# Altium project ESP32_S3_V2.1.PrjPcb
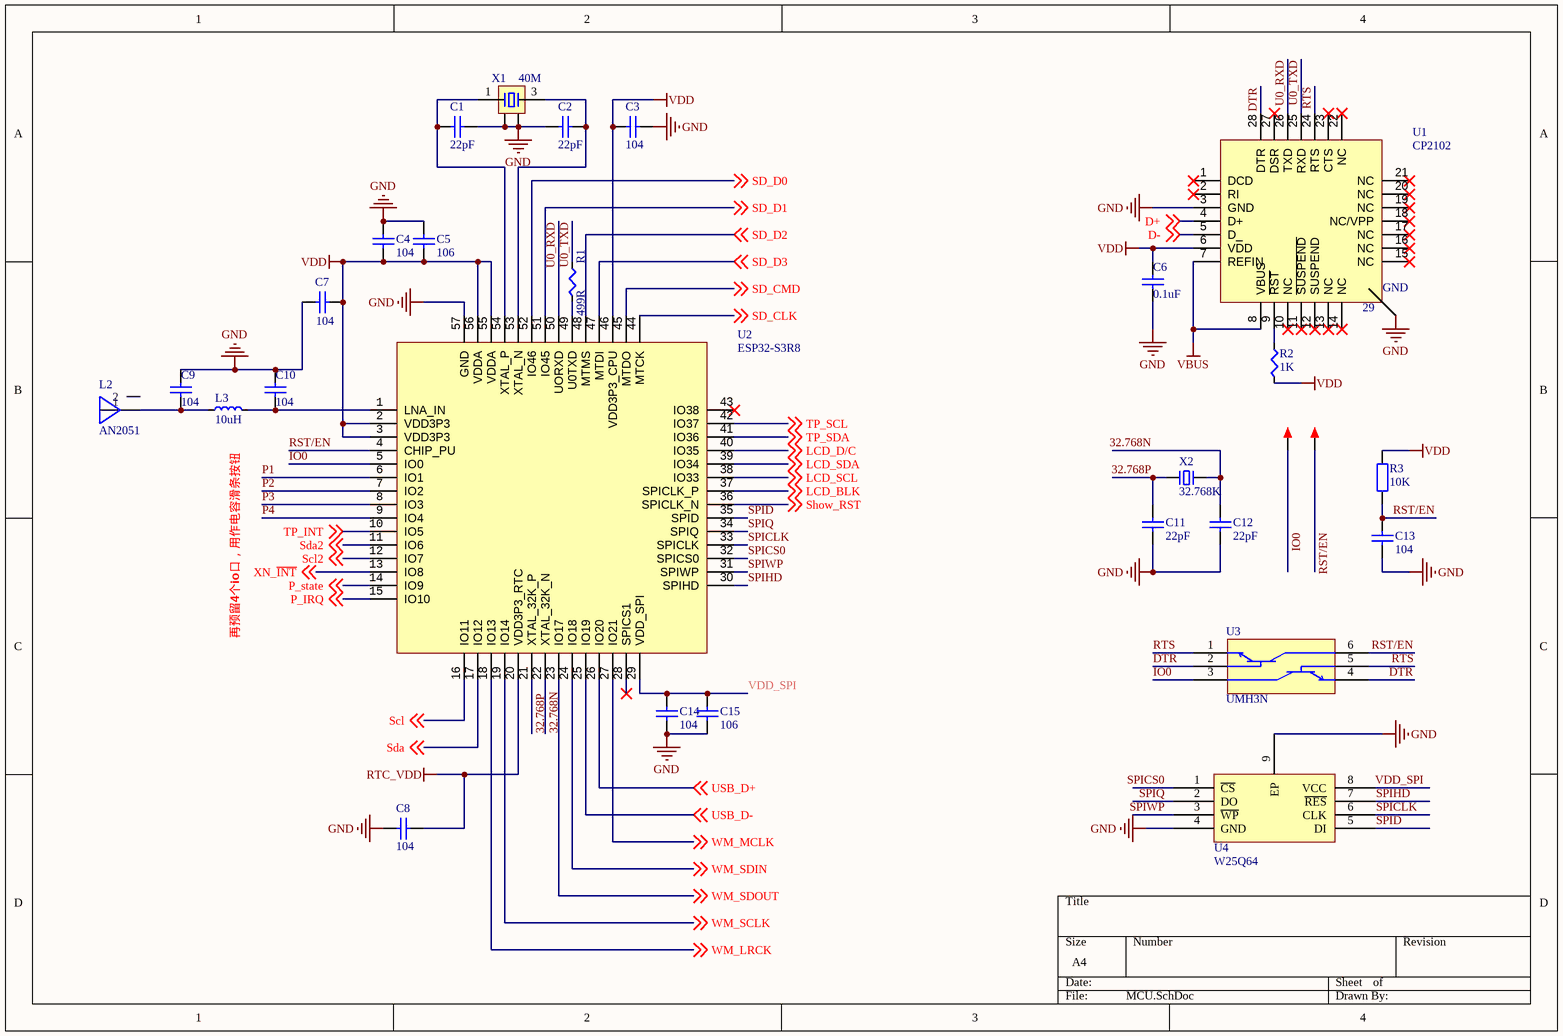
[diagram p0: MCU.SchDoc]
3 sheets, 117 parts. Net scope: global (net labels, ports and power ports of the same name join across sheets).
Board file: PCB1.~(1).PcbDoc
Sheets:
  MCU.SchDoc
  peripheral.SchDoc
  power.SchDoc

## Sheet MCU.SchDoc
size A4; SheetNumber: 1; SheetTotal: 3

### Parts
C1  22pF  [C 0603_L]
C2  22pF  [C 0603_L]
C3  104  [C 0603_L]
C4  104  [C 0603_L]
C5  106  [C 0603_L]
C6  0.1uF  [C 0603_L]
C7  104  [C 0603_L]
C8  104  [C 0603_L]
C9  104  [C 0603_L]
C10  104  [C 0603_L]
C11  22pF  [C 0603_L]
C12  22pF  [C 0603_L]
C13  104  [C 0603_L]
C14  104  [C 0603_L]
C15  106  [C 0603_L]
L2  AN2051  [AN9520]
L3  10uH  [L 0603]
R1  499R  [R 0603_L]
R2  1K  [R 0603_L]
R3  10K  [R 0603_L]
TP1  TEST  [TEST 1]  (value not drawn)
TP2  TEST  [TEST 1]  (value not drawn)
U1  CP2102  [QFN28 5x5_M]
U2  ESP32-S3R8  [QFN56  7x7]
U3  UMH3N  [SOT-363]
U4  W25Q64  [WSON-8_L8.0-W6.0-P1.27-TL-EP]
X1  40M  [OSC 3225-4P]
X2  32.768K  [OSC 3215-2P]

### Nets
GND: C1.2 C2.1 C3.2 C4.2 C5.2 C6.1 C7.1 C8.2 C9.2 C10.2 C11.1 C12.1 C13.1 C14.1 C15.1 U1.3(GND) U1.29(GND) U2.57(GND) U4.4(GND) U4.9(EP) X1.2 X1.4
RTC_VDD: C8.1 U2.20(VDD3P3_RTC)
VBUS: U1.7(REFIN) U1.8(VBUS)
VDD: C3.1 C4.1 C5.1 C6.2 C7.2 R2.1 R3.2 U1.6(VDD) U2.2(VDD3P3) U2.3(VDD3P3) U2.46(VDD3P3_CPU) U2.55(VDDA) U2.56(VDDA)
32.768N: C12.2 U2.22(XTAL_32K_N) X2.1
32.768P: C11.2 U2.21(XTAL_32K_P) X2.2
D+: U1.4(D+) ; off-sheet D+
D-: U1.5(D_) ; off-sheet D-
DTR: U1.28(DTR) U3.2(B2) U3.4(E2)
IO0: TP1.1 U2.5(IO0) U3.3(C2)
LCD_BLK: U2.37(SPICLK_P) ; off-sheet LCD_BLK
LCD_D/C: U2.40(IO35) ; off-sheet LCD_D/C
LCD_SCL: U2.38(IO33) ; off-sheet LCD_SCL
LCD_SDA: U2.39(IO34) ; off-sheet LCD_SDA
P1: U2.6(IO1)
P2: U2.7(IO2)
P3: U2.8(IO3)
P4: U2.9(IO4)
P_IRQ: U2.15(IO10) ; off-sheet P_IRQ
P_state: U2.14(IO9) ; off-sheet P_state
RST/EN: C13.2 R3.1 TP2.1 U2.4(CHIP_PU) U3.6(C1)
RTS: U1.24(RTS) U3.1(E1) U3.5(B2)
Scl: U2.16(IO11) ; off-sheet Scl
Scl2: U2.12(IO7) ; off-sheet Scl2
SD_CLK: U2.44(MTCK) ; off-sheet SD_CLK
SD_CMD: U2.45(MTDO) ; off-sheet SD_CMD
SD_D0: U2.52(IO46) ; off-sheet SD_D0
SD_D1: U2.51(IO45) ; off-sheet SD_D1
SD_D2: U2.48(MTMS) ; off-sheet SD_D2
SD_D3: U2.47(MTDI) ; off-sheet SD_D3
Sda: U2.17(IO12) ; off-sheet Sda
Sda2: U2.11(IO6) ; off-sheet Sda2
Show_RST: U2.36(SPICLK_N) ; off-sheet Show_RST
SPICLK: U2.33(SPICLK) U4.6(CLK)
SPICS0: U2.32(SPICS0) U4.1(~{CS})
SPID: U2.35(SPID) U4.5(DI)
SPIHD: U2.30(SPIHD) U4.7(~{RES})
SPIQ: U2.34(SPIQ) U4.2(DO)
SPIWP: U2.31(SPIWP) U4.3(~{WP})
TP_INT: U2.10(IO5) ; off-sheet TP_INT
TP_SCL: U2.42(IO37) ; off-sheet TP_SCL
TP_SDA: U2.41(IO36) ; off-sheet TP_SDA
U0_RXD: U1.26(TXD) U2.50(UORXD)
U0_TXD: R1.2 U1.25(RXD)
USB_D+: U2.26(IO20) ; off-sheet USB_D+
USB_D-: U2.25(IO19) ; off-sheet USB_D-
VDD_SPI: C14.2 C15.2 U2.29(VDD_SPI) U4.8(VCC)
WM_LRCK: U2.18(IO13) ; off-sheet WM_LRCK
WM_MCLK: U2.27(IO21) ; off-sheet WM_MCLK
WM_SCLK: U2.19(IO14) ; off-sheet WM_SCLK
WM_SDIN: U2.24(IO18) ; off-sheet WM_SDIN
WM_SDOUT: U2.23(IO17) ; off-sheet WM_SDOUT
XN_~{INT}: U2.13(IO8) ; off-sheet XN_~{INT}
NetC1_1: C1.1 U2.54(XTAL_P) X1.1
NetC2_2: C2.2 U2.53(XTAL_N) X1.3
NetC9_1: C9.1 L2.1 L3.1
NetC10_1: C10.1 L3.2 U2.1(LNA_IN)
NetR1_1: R1.1 U2.49(U0TXD)
NetR2_2: R2.2 U1.9(~{RST})

Not connected (* = marked no-connect by the designer): L2 2; U1 1(DCD)* 2(RI)* 10(NC)* 11(~{SUSPEND})* 12(SUSPEND)* 13(NC)* 14(NC)* 15(NC)* 16(NC)* 17(NC)* 18(NC/VPP)* 19(NC)* 20(NC)* 21(NC)* 22(NC)* 23(CTS)* 27(DSR)*; U2 28(SPICS1)* 43(IO38)*

### Notes on the sheet
- 再预留4个io口，用作电容滑条按钮

### Library data of the parts
C1-C15 = C: 贴片电容; BOM名称: 无极性贴片电容; 联系卖家，免费查找封装: 唯一出售店铺网址https://shop463601444.taobao.com; 封装库来自淘宝卖家ID：黄晶宝石: 其他店铺购入均为盗版假冒封装库
L2 = AN2051: AN2051-245 2.4G蓝牙wifi 贴片 2051
L3 = L: 小功率贴片电感; 联系卖家，免费查找封装: 唯一出售店铺网址https://shop463601444.taobao.com; 封装库来自淘宝卖家ID：黄晶宝石: 其他店铺购入均为盗版假冒封装库; BOM名称: 小功率贴片电感
R1-R3 = R: 贴片电阻; 联系卖家，免费查找封装: 唯一出售店铺网址https://shop463601444.taobao.com; 封装库来自淘宝卖家ID：黄晶宝石: 其他店铺购入均为盗版假冒封装库; BOM名称: 贴片电阻
TP1 TP2 = TEST: 测试点; 联系卖家，免费查找封装: 唯一出售店铺网址https://shop463601444.taobao.com; BOM名称: 测试点
U1 = CP2102: USB转TTL
U2 = ESP32S3: ESP32S3  7x7
U3 = UMH3N: 2NPN预偏式(双)
U4 = W25Q64——wson: C77819
X1 = XTAL-4P: 4脚无源晶振; 联系卖家，免费查找封装: 唯一出售店铺网址https://shop463601444.taobao.com; BOM名称: 4脚无源晶振
X2 = XTAL-2P: 2脚无源脚晶振; 联系卖家，免费查找封装: 唯一出售店铺网址https://shop463601444.taobao.com; BOM名称: 2脚无源脚晶振

## Sheet peripheral.SchDoc
size A4; SheetNumber: 2; SheetTotal: 3
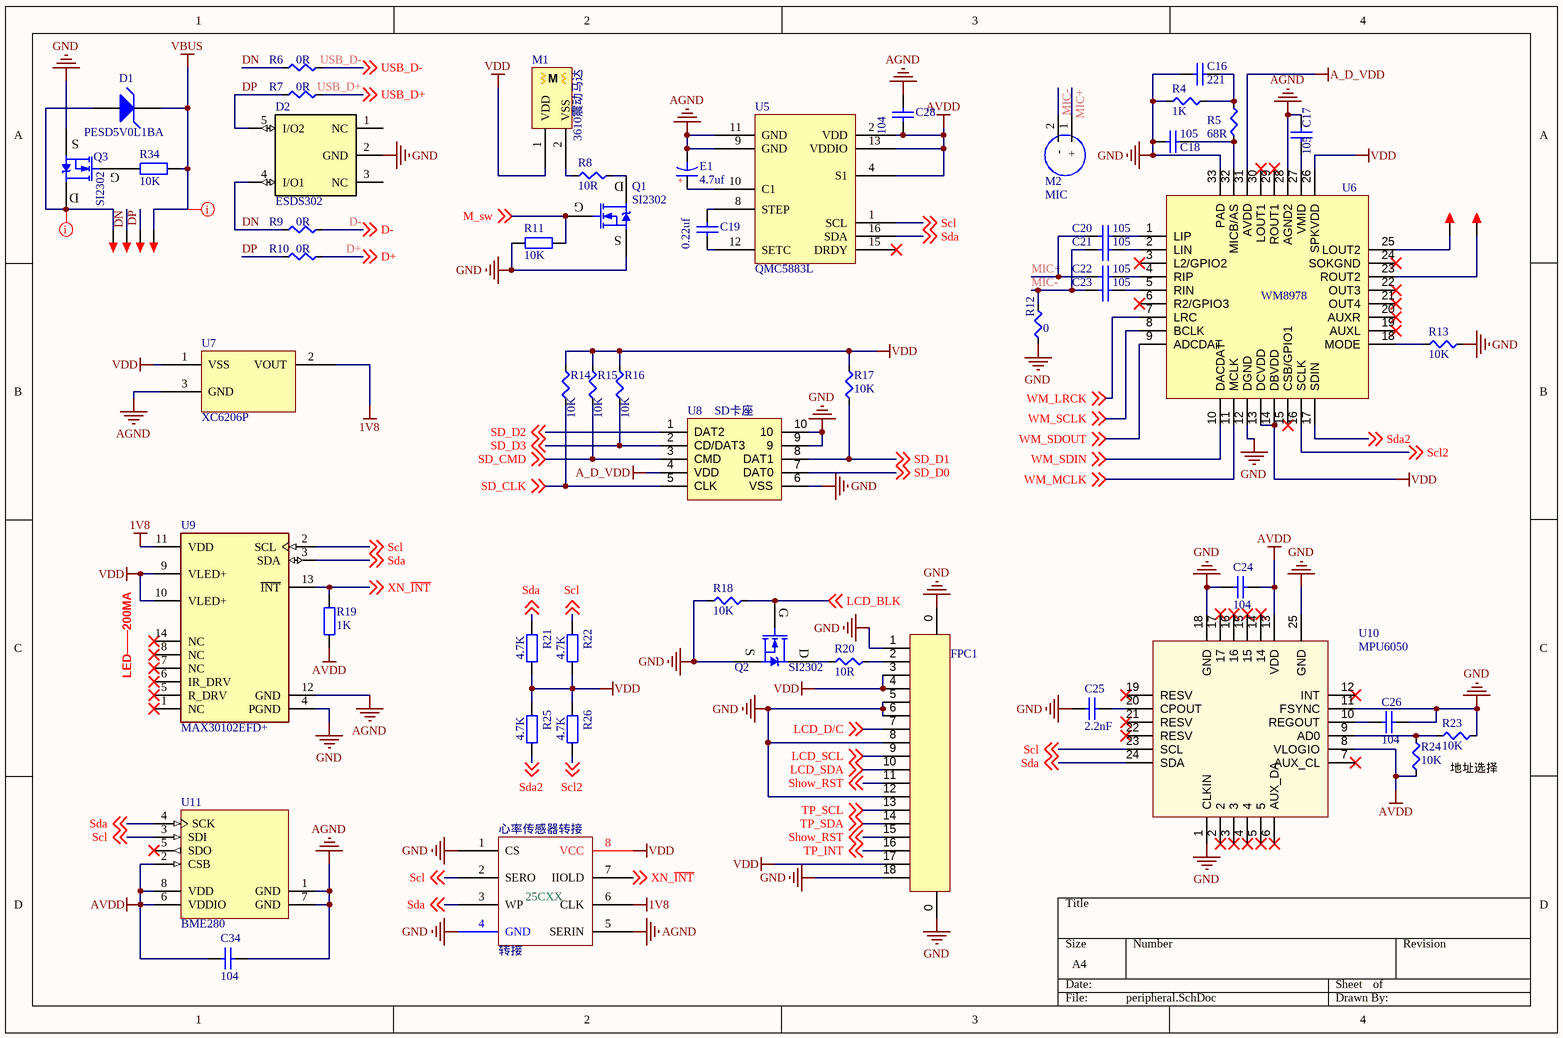
[diagram p1: peripheral.SchDoc]

### Parts
C16  221  [C 0603_L]
C17  105  [C 0603_L]
C18  105  [C 0603_L]
C19  0.22uf  [C 0603_L]
C20  105  [C 0603_L]
C21  105  [C 0603_L]
C22  105  [C 0603_L]
C23  105  [C 0603_L]
C24  104  [C 0603_L]
C25  2.2nF  [C 0603_L]
C26  104  [C 0603_L]
C28  104  [C 0603_L]
C34  104  [C 0603_L]
D1  PESD5V0L1BA  [SOD-323]
D2  ESDS302  [SOT23-5]
E1  4.7uf  [CD A(3216)]
FPC1  FPC  [FPC0.5 2H-WS-18P]  (value not drawn)
M1  3610震动马达
M2  MIC  [驻极体电容咪头（ECM）]
Q1  SI2302  [SOT23-3N]
Q2  SI2302  [SOT23-3N]
Q3  SI2302  [SOT23-3N]
R4  1K  [R 0603_L]
R5  68R  [R 0603_L]
R6  0R  [R 0603_L]
R7  0R  [R 0603_L]
R8  10R  [R 0603_L]
R9  0R  [R 0603_L]
R10  0R  [R 0603_L]
R11  10K  [R 0603_L]
R12  0  [R 0603_L]
R13  10K  [R 0603_L]
R14  10K  [R 0603_L]
R15  10K  [R 0603_L]
R16  10K  [R 0603_L]
R17  10K  [R 0603_L]
R18  10K  [R 0603_L]
R19  1K  [R 0603_L]
R20  10R  [R 0603_L]
R21  4.7K  [R 0603_L]
R22  4.7K  [R 0603_L]
R23  10K  [R 0603_L]
R24  10K  [R 0603_L]
R25  4.7K  [R 0603_L]
R26  4.7K  [R 0603_L]
R34  10K  [R 0603_L]
TP3  TEST  [TEST 1]  (value not drawn)
TP4  TEST  [TEST 1]  (value not drawn)
TP5  TEST  [TEST 1]  (value not drawn)
TP6  TEST  [TEST 1]  (value not drawn)
TP7  TEST  [TEST 1]  (value not drawn)
TP8  TEST  [TEST 1]  (value not drawn)
U5  QMC5883L  [LGA-16_L3.0-W3.0-P0.50-BL_SQ]
U6  WM8978  [QFN32-P50]
U7  XC6206P  [SOT23]
U8  SD卡座  [SD卡座]
U9  MAX30102EFD+  [FP-F143A5-1-MFG]
U10  MPU6050  [QFN24 4x4_N]
U11  BME280  [BOSC-BME280-8_V]
心率传感器转接  转接  [SOP8改]

### Nets
1V8: U7.2(VOUT) U9.11(VDD) 心率传感器转接.6(CLK)
A_D_VDD: U6.31(AVDD) U8.4(VDD)
AGND: C17.2 C28.2 C34.1 E1.2(K) U5.9(GND) U5.11(GND) U6.28(AGND2) U7.3(GND) U9.12(GND) U11.1(GND) U11.7(GND) 心率传感器转接.5(SERIN)
AVDD: C24.1 C28.1 C34.2 R19.1 R24.1 U5.2(VDD) U5.4(S1) U5.13(VDDIO) U10.8(VLOGIO) U10.13(VDD) U11.2(CSB) U11.6(VDDIO) U11.8(VDD)
GND: C16.1 C18.1 C24.2 C25.2 C26.1 D2.2(GND) FPC1.0 FPC1.1 FPC1.5 FPC1.6 FPC1.8 FPC1.12 FPC1.18 Q1.2(S) Q2.2(S) Q3.2(S) R4.1 R11.1 R12.1 R13.2 R18.1 R23.2 U6.12(DGND) U6.33(PAD) U8.6(VSS) U8.9 U8.10 U9.4(PGND) U10.1(CLKIN) U10.11(FSYNC) U10.18(GND) U10.25(GND) 心率传感器转接.1(CS) 心率传感器转接.4(GND)
VBUS: D1.2(K) R34.2 TP8.1
VDD: FPC1.3 FPC1.4 FPC1.17 M1.1(VDD) R14.2 R15.2 R16.2 R17.2 R21.2 R22.2 R25.1 R26.1 U6.13(DCVDD) U6.14(DBVDD) U6.26(SPKVDD) U7.1(VSS) U9.9(VLED+) U9.10(VLED+) 心率传感器转接.8(VCC)
D+: R10.2 ; off-sheet D+
D-: R9.2 ; off-sheet D-
DN: D2.4(I/O1) R6.1 R9.1 TP7.1
DP: D2.5(I/O2) R7.1 R10.1 TP4.1
LCD_BLK: Q2.1(G) R18.2 ; off-sheet LCD_BLK
LCD_D/C: FPC1.7 ; off-sheet LCD_D/C
LCD_SCL: FPC1.9 ; off-sheet LCD_SCL
LCD_SDA: FPC1.10 ; off-sheet LCD_SDA
M_sw: Q1.1(G) R11.2 ; off-sheet M_sw
MIC+: C20.1 C22.1 M2.1(+)
MIC-: C21.1 C23.1 M2.2(-) R12.2
Scl: R22.1 U5.1(SCL) U9.2(SCL) U10.23(SCL) U11.3(SDI) 心率传感器转接.2(SERO) ; off-sheet Scl
Scl2: R26.2 U6.16(SCLK) ; off-sheet Scl2
SD_CLK: R14.1 U8.5(CLK) ; off-sheet SD_CLK
SD_CMD: R15.1 U8.3(CMD) ; off-sheet SD_CMD
SD_D0: U8.7(DAT0) ; off-sheet SD_D0
SD_D1: R17.1 U8.8(DAT1) ; off-sheet SD_D1
SD_D2: U8.1(DAT2) ; off-sheet SD_D2
SD_D3: R16.1 U8.2(CD/DAT3) ; off-sheet SD_D3
Sda: R21.1 U5.16(SDA) U9.3(SDA) U10.24(SDA) U11.4(SCK) 心率传感器转接.3(WP) ; off-sheet Sda
Sda2: R25.2 U6.17(SDIN) ; off-sheet Sda2
Show_RST: FPC1.11 FPC1.15 ; off-sheet Show_RST
TP_INT: FPC1.16 ; off-sheet TP_INT
TP_SCL: FPC1.13 ; off-sheet TP_SCL
TP_SDA: FPC1.14 ; off-sheet TP_SDA
USB_D+: R7.2 ; off-sheet USB_D+
USB_D-: R6.2 ; off-sheet USB_D-
WM_LRCK: U6.7(LRC) ; off-sheet WM_LRCK
WM_MCLK: U6.11(MCLK) ; off-sheet WM_MCLK
WM_SCLK: U6.8(BCLK) ; off-sheet WM_SCLK
WM_SDIN: U6.10(DACDAT) ; off-sheet WM_SDIN
WM_SDOUT: U6.9(ADCDAT) ; off-sheet WM_SDOUT
XN_~{INT}: R19.2 U9.13(~{INT}) 心率传感器转接.7(IIOLD) ; off-sheet XN_~{INT}
NetC16_2: C16.2 R4.2 R5.2
NetC17_1: C17.1 U6.27(VMID)
NetC18_2: C18.2 R5.1 U6.32(MICB/AS)
NetC19_1: C19.1 U5.12(SETC)
NetC19_2: C19.2 U5.8(STEP)
NetC20_2: C20.2 U6.1(LIP)
NetC21_2: C21.2 U6.2(LIN)
NetC22_2: C22.2 U6.4(RIP)
NetC23_2: C23.2 U6.5(RIN)
NetC25_1: C25.1 U10.20(CPOUT)
NetC26_2: C26.2 U10.10(REGOUT)
NetD1_1: D1.1(A) Q3.3(D) TP3.1
NetE1_1: E1.1(A) U5.10(C1)
NetFPC1_2: FPC1.2 R20.2
NetM1_2: M1.2(VSS) R8.1
NetQ1_3: Q1.3(D) R8.2
NetQ2_3: Q2.3(D) R20.1
NetQ3_1: Q3.1(G) R34.1
NetR13_1: R13.1 U6.18(MODE)
NetR23_1: R23.1 R24.2 U10.9(AD0)
NetTP5_1: TP5.1 U6.25(LOUT2)
NetTP6_1: TP6.1 U6.23(ROUT2)

Not connected (* = marked no-connect by the designer): D2 1(NC) 3(NC); U5 15(DRDY)*; U6 3(L2/GPIO2)* 6(R2/GPIO3)* 15(CSB/GPIO1)* 19(AUXL)* 20(AUXR)* 21(OUT4)* 22(OUT3)* 24(SOKGND)* 29(ROUT1)* 30(LOUT1)*; U9 1(NC)* 5(R_DRV)* 6(IR_DRV)* 7(NC)* 8(NC)* 14(NC)*; U10 2* 3* 4* 5* 6(AUX_DA)* 7(AUX_CL)* 12(INT)* 14* 15* 16* 17* 19(RESV)* 21(RESV)* 22(RESV)*; U11 5(SDO)*

### Layout directives
net class Power: NetD1_1, VBUS

### Notes on the sheet
- (near U9) LED——200MA
- (near FPC1) GND
- (near FPC1) LEDK
- (near FPC1) VCC
- (near FPC1) LOVCC
- (near FPC1) D/C
- (near FPC1) CS
- (near FPC1) SCL
- (near FPC1) SDA
- (near FPC1) RESET
- 地址选择
- (near FPC1) TPSCL
- (near FPC1) TPSDA
- (near FPC1) TPRST
- (near FPC1) TPINT
- (near FPC1) VDD
- (in symbol CT) +
- (in symbol 贴片震动电机3610) M

### Library data of the parts
C16-C26 C28 C34 = C: as C1 on sheet MCU
D1 = PESD3V3L1BA: 3.3v ESD
D2 = ESD: USB2.0/Dual 2.3-pF, 3.6-V, ±30-kV
E1 = CT: 贴片钽电容; 联系卖家，免费查找封装: 唯一出售店铺网址https://shop463601444.taobao.com; 封装库来自淘宝卖家ID：黄晶宝石: 其他店铺购入均为盗版假冒封装库; BOM名称: 贴片钽电容
FPC1 = FPC18Pin: FPC 连接座,脚距0.5
M1 = 贴片震动电机3610
M2 = MIC: 驻极体电容咪头（ECM）φ4.5 x H2.2 mm
Q1-Q3 = SI2302: N沟道场效应管; 联系卖家，免费查找封装: 唯一出售店铺网址https://shop463601444.taobao.com; BOM名称: N沟道场效应管
R4-R26 R34 = R: as R1 on sheet MCU; BOM名称: 贴片电阻
TP3-TP8 = TEST: as TP1 on sheet MCU; BOM名称: 测试点
U5 = QMC5883L: 三轴磁传感器
U6 = WM9878: 音频编解码芯片
U7 = XC6206P: 最大输入电压：7V / 最大输出电流：200mA / 输入输出压差：200mV / 命名：（XC6205P）18代表1.8V
U8 = SD卡座: SD卡座 简易短体式带壳
U9 = CMP-05738-000003-1: IC SENSOR OXIMETER/HEARTRATE; Manufacturer: Maxim Integrated; Max Junction Temp: +90°C; Min Supply Voltage: 1.7V; Sensor Output: I2C; Operating Supply Current: 600uA; Max Supply Voltage: 2V; Package: F143A5-1; Manufacturer Part Number: MAX30102EFD+; Footprint Url: https://pdfserv.maximintegrated.com/land_patterns/90-0602.PDF; ComponentLink2URL: https://datasheets.maximintegrated.com/en/ds/MAX30102.pdf; Temperature: -40°C to +85°C; Device Class L2: unset; Mouser Description: Pulse Oximeter/Heart Rate Sensor, Oesip; Temperature Range High: +85°C; Automotive: No; Height: 1.65mm; Digikey Description: IC SENSOR OXIMETER/HEARTRATE; Category: IC; Lead Free: Yes; RoHS: TRUE; Temperature Range Low: -40°C; ComponentLink2Description: Datasheet; Octopart: https://octopart.com/max30102efd%2B-maxim+integrated-59568799; Device Class L3: unset; Device Class L1: Sensors
U10 = MPU6050: QFN24 4X4三轴加速度+三轴陀螺仪; 联系卖家，免费查找封装: 唯一出售店铺网址https://shop463601444.taobao.com
U11 = CMP-2000-05073-1: Combined Humidity and Pressure Sensor, 1.71 to 3.6 V, -40 to 85 degC, 8-Pin SMD, RoHS, Tape and Reel; Manufacturer: Bosch Sensortec; Datasheet Version: Rev. 1.2, 10/2015; Datasheet URL: http://datasheet.octopart.com/BME280-Bosch-datasheet-58577763.pdf; Manufacturer URL: http://www.bosch-sensortec.com
心率传感器转接 = 25CXX: 联系卖家，免费查找封装: 唯一出售店铺网址https://shop463601444.taobao.com

## Sheet power.SchDoc
size A4; SheetNumber: 3; SheetTotal: 3
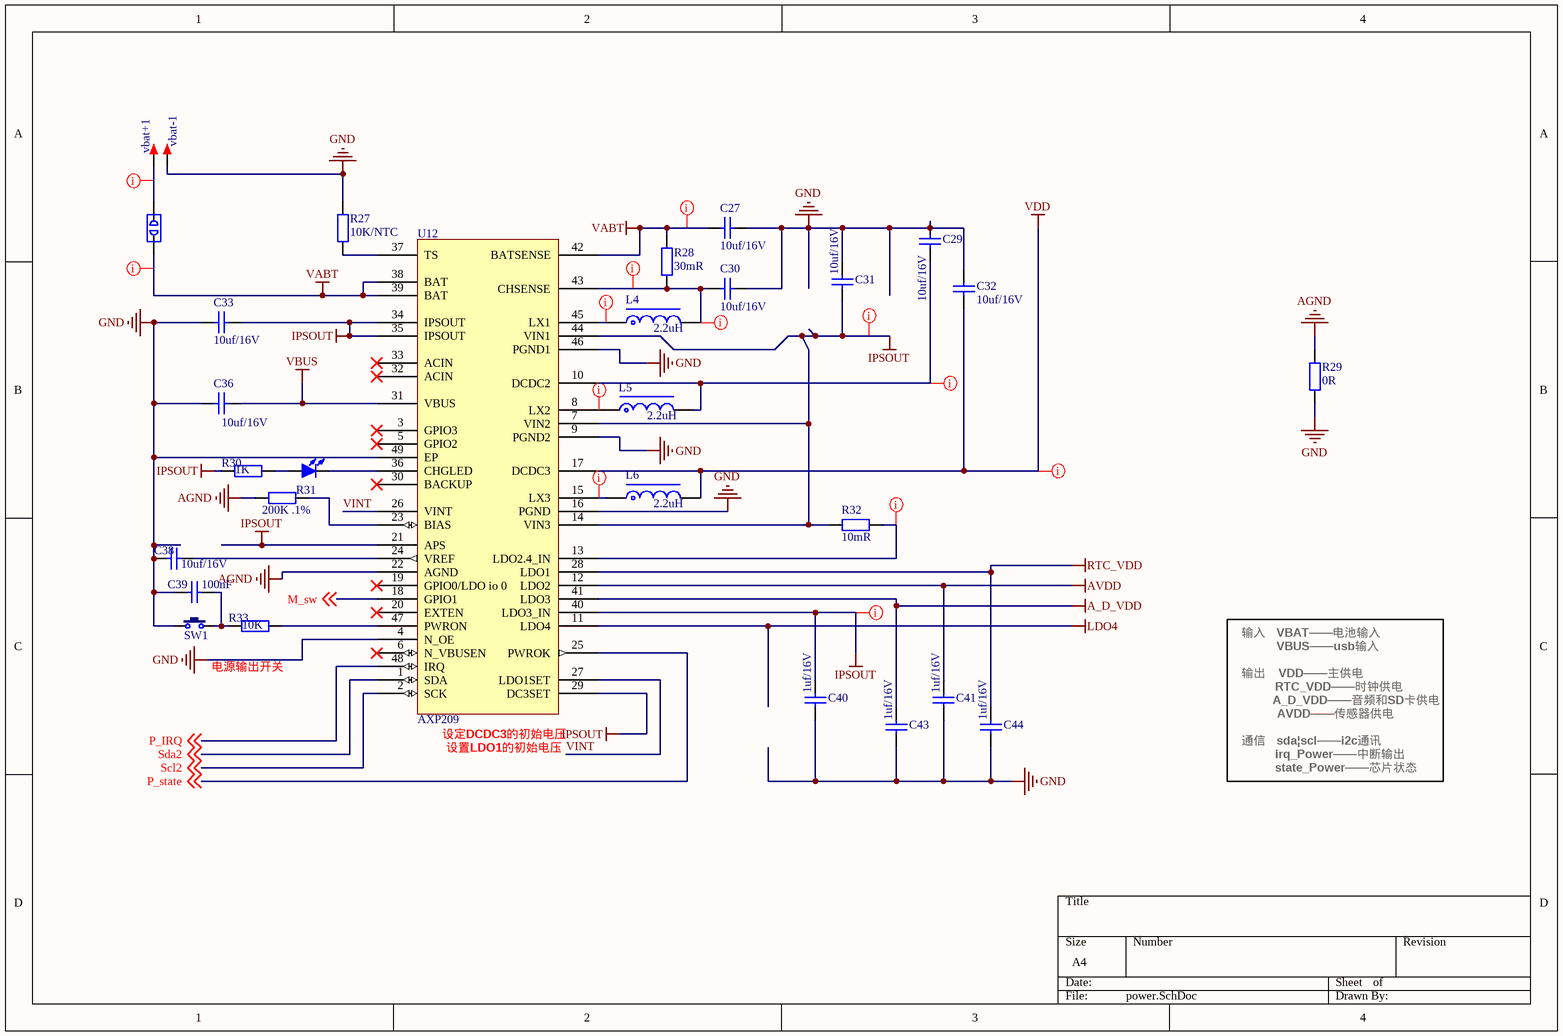
[diagram p2: power.SchDoc]

### Parts
C27  10uf/16V  [C 0603_L]
C29  10uf/16V  [C 0603_L]
C30  10uf/16V  [C 0603_L]
C31  10uf/16V  [C 0603_L]
C32  10uf/16V  [C 0603_L]
C33  10uf/16V  [C 0603_L]
C36  10uf/16V  [C 0603_L]
C38  10uf/16V  [C 0603_L]
C39  100nF  [C 0603_L]
C40  1uf/16V  [C 0603_L]
C41  1uf/16V  [C 0603_L]
C43  1uf/16V  [C 0603_L]
C44  1uf/16V  [C 0603_L]
DE2  DEBUG PAD  [DEBUG_B]  (value not drawn)
L4  2.2uH  [NR2520]
L5  2.2uH  [NR2520]
L6  2.2uH  [NR2520]
LED1  红色  [LED 0603W]  (value not drawn)
R27  10K/NTC  [R 0603_L]
R28  30mR  [R 0805_L]
R29  0R  [R 0603_L]
R30  1K  [R 0603_L]
R31  200K .1%  [R 0603_L]
R32  10mR  [R 0805_L]
R33  10K  [R 0603_L]
SW1  3x6x5  [TSW 3*6*4.3-S-W]  (value not drawn)
U12  AXP209  [QFN-48_L6.0-W6.0-P0.40-TL-EP4.2]
vbat+1  TEST  [TEST 1.6]  (value not drawn)
vbat-1  TEST  [TEST 1.6]  (value not drawn)

### Nets
A_D_VDD: C43.1 U12.41(LDO3)
AGND: R29.2 R31.1 U12.22(AGND)
AVDD: C41.1 U12.12(LDO2)
GND: C27.1 C29.1 C30.1 C31.1 C32.1 C33.2 C36.1 C38.1 C39.1 C40.2 C41.2 C43.2 C44.2 R27.1 R29.1 SW1.1 U12.4(N_OE) U12.9(PGND2) U12.16(PGND) U12.46(PGND1) U12.49(EP) vbat-1.1
IPSOUT: C31.2 C33.1 C40.1 R30.1 R32.1 U12.7(VIN2) U12.14(VIN3) U12.21(APS) U12.29(DC3SET) U12.34(IPSOUT) U12.35(IPSOUT) U12.40(LDO3_IN) U12.44(VIN1)
LDO4: U12.11(LDO4)
RTC_VDD: C44.1 U12.28(LDO1)
VABT: C27.2 DE2.2 R28.2 U12.38(BAT) U12.39(BAT) U12.42(BATSENSE)
VBUS: C36.2 U12.31(VBUS)
VDD: C32.2 L6.2 U12.17(DCDC3)
M_sw: U12.18(GPIO1) ; off-sheet M_sw
P_IRQ: U12.48(IRQ) ; off-sheet P_IRQ
P_state: U12.25(PWROK) ; off-sheet P_state
Scl2: U12.2(SCK) ; off-sheet Scl2
Sda2: U12.1(SDA) ; off-sheet Sda2
VINT: U12.26(VINT) U12.27(LDO1SET)
NetC29_2: C29.2 L5.2 U12.10(DCDC2)
NetC30_2: C30.2 L4.2 R28.1 U12.43(CHSENSE)
NetC38_2: C38.2 U12.24(VREF)
NetC39_2: C39.2 R33.1 SW1.2
NetDE2_1: DE2.1 vbat+1.1
NetL4_1: L4.1 U12.45(LX1)
NetL5_1: L5.1 U12.8(LX2)
NetL6_1: L6.1 U12.15(LX3)
NetLED1_1: LED1.1(A) R30.2
NetLED1_2: LED1.2(K) U12.36(CHGLED)
NetR27_2: R27.2 U12.37(TS)
NetR31_2: R31.2 U12.23(BIAS)
NetR32_2: R32.2 U12.13(LDO2.4_IN)
NetR33_2: R33.2 U12.47(PWRON)

Not connected (* = marked no-connect by the designer): U12 3(GPIO3)* 5(GPIO2)* 6(N_VBUSEN)* 19(GPIO0/LDO_io_0)* 20(EXTEN)* 30(BACKUP)* 32(ACIN)* 33(ACIN)*

### Layout directives
net class Power: IPSOUT, NetC29_2, NetC30_2, NetDE2_1, NetL4_1, NetL5_1, NetL6_1, NetR32_2, VABT, VDD

### Notes on the sheet
- 输入
- VBUS——usb输入
- VBAT——电池输入
- 电源输出开关
- 输出
- VDD——主供电
- AVDD——传感器供电
- RTC_VDD——时钟供电
- A_D_VDD——音频和SD卡供电
- (near U12) 设定DCDC3的初始电压
- (near U12) 设置LDO1的初始电压
- 通信
- sda|scl——i2c通讯
- irq_Power——中断输出
- state_Power——芯片状态

### Library data of the parts
C27 C29-C33 C36 C38-C41 C43 C44 = C: as C1 on sheet MCU
DE2 = DEBUG: 调试断点焊盘; 联系卖家，免费查找封装: 唯一出售店铺网址https://shop463601444.taobao.com; BOM名称: 调试断点焊盘
L4-L6 = L-NR: NR磁胶电感; 联系卖家，免费查找封装: 唯一出售店铺网址https://shop463601444.taobao.com; 封装库来自淘宝卖家ID：黄晶宝石: 其他店铺购入均为盗版假冒封装库; BOM名称: NR磁胶电感
LED1 = LED-SMD: 贴片LED; 封装库来自淘宝卖家 ID：黄晶宝石: 其他店铺购入均为假冒，请立即申请退款，本店奖励2~5元现金; BOM名称: 贴片LED
R27-R33 = R: as R1 on sheet MCU; BOM名称: 贴片电阻
SW1 = TSW 3x6: 3x6轻触开关; 联系卖家，免费查找封装: 唯一出售店铺网址https://shop463601444.taobao.com; BOM名称: 3x6轻触开关
U12 = AXP209: 高度集 成的电源系统管 理芯片 ， 针对单芯 锂电池( 锂离子或 锂聚合物) 且需要多 路电源转换 / 输出 的应用 ，提供简 单易用 而又可以 灵活配 置的完整 电源解 决方案， 充分满 足目前日 益复杂 的应用处 理 / 器系统对 于电源精确控制 的要求
vbat+1 vbat-1 = TEST: as TP1 on sheet MCU; BOM名称: 测试点

## Nets that join several sheets
A_D_VDD: peripheral (U6.31 U8.4), power (C43.1 U12.41)
AGND: peripheral (12 pins), power (R29.2 R31.1 U12.22)
AVDD: peripheral (13 pins), power (C41.1 U12.12)
GND: MCU (22 pins), peripheral (34 pins), power (22 pins)
RTC_VDD: MCU (C8.1 U2.20), power (C44.1 U12.28)
VBUS: MCU (U1.7 U1.8), peripheral (D1.2 R34.2 TP8.1), power (C36.2 U12.31)
VDD: MCU (13 pins), peripheral (19 pins), power (C32.2 L6.2 U12.17)
D+: MCU (U1.4), peripheral (R10.2)
D-: MCU (U1.5), peripheral (R9.2)
LCD_BLK: MCU (U2.37), peripheral (Q2.1 R18.2)
LCD_D/C: MCU (U2.40), peripheral (FPC1.7)
LCD_SCL: MCU (U2.38), peripheral (FPC1.9)
LCD_SDA: MCU (U2.39), peripheral (FPC1.10)
M_sw: peripheral (Q1.1 R11.2), power (U12.18)
P_IRQ: MCU (U2.15), power (U12.48)
P_state: MCU (U2.14), power (U12.25)
Scl: MCU (U2.16), peripheral (6 pins)
Scl2: MCU (U2.12), peripheral (R26.2 U6.16), power (U12.2)
SD_CLK: MCU (U2.44), peripheral (R14.1 U8.5)
SD_CMD: MCU (U2.45), peripheral (R15.1 U8.3)
SD_D0: MCU (U2.52), peripheral (U8.7)
SD_D1: MCU (U2.51), peripheral (R17.1 U8.8)
SD_D2: MCU (U2.48), peripheral (U8.1)
SD_D3: MCU (U2.47), peripheral (R16.1 U8.2)
Sda: MCU (U2.17), peripheral (6 pins)
Sda2: MCU (U2.11), peripheral (R25.2 U6.17), power (U12.1)
Show_RST: MCU (U2.36), peripheral (FPC1.11 FPC1.15)
TP_INT: MCU (U2.10), peripheral (FPC1.16)
TP_SCL: MCU (U2.42), peripheral (FPC1.13)
TP_SDA: MCU (U2.41), peripheral (FPC1.14)
USB_D+: MCU (U2.26), peripheral (R7.2)
USB_D-: MCU (U2.25), peripheral (R6.2)
WM_LRCK: MCU (U2.18), peripheral (U6.7)
WM_MCLK: MCU (U2.27), peripheral (U6.11)
WM_SCLK: MCU (U2.19), peripheral (U6.8)
WM_SDIN: MCU (U2.24), peripheral (U6.10)
WM_SDOUT: MCU (U2.23), peripheral (U6.9)
XN_~{INT}: MCU (U2.13), peripheral (R19.2 U9.13 心率传感器转接.7)